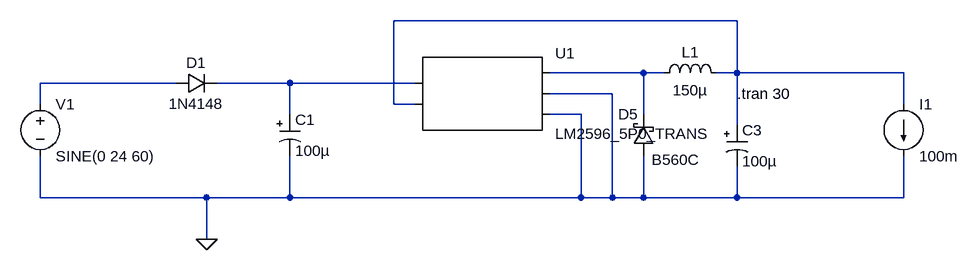
[diagram p0: schematic 24AC_new.asc]
24AC_new.asc, the LTspice schematic file:
Version 4
SHEET 1 2044 680
WIRE 1296 64 768 64
WIRE 1152 144 1008 144
WIRE 1184 144 1152 144
WIRE 1296 144 1296 64
WIRE 1296 144 1264 144
WIRE 1552 144 1296 144
WIRE 432 160 224 160
WIRE 608 160 496 160
WIRE 800 160 608 160
WIRE 1104 176 1008 176
WIRE 224 192 224 160
WIRE 768 192 768 64
WIRE 800 192 768 192
WIRE 1552 192 1552 144
WIRE 608 208 608 160
WIRE 1056 208 1008 208
WIRE 1152 208 1152 144
WIRE 1296 224 1296 144
WIRE 224 336 224 272
WIRE 480 336 224 336
WIRE 608 336 608 272
WIRE 608 336 480 336
WIRE 1056 336 1056 208
WIRE 1056 336 608 336
WIRE 1104 336 1104 176
WIRE 1104 336 1056 336
WIRE 1152 336 1152 272
WIRE 1152 336 1104 336
WIRE 1296 336 1296 288
WIRE 1296 336 1152 336
WIRE 1552 336 1552 272
WIRE 1552 336 1296 336
WIRE 480 400 480 336
FLAG 480 400 0
SYMBOL voltage 224 176 R0
WINDOW 123 24 124 Left 2
WINDOW 39 0 0 Left 0
SYMATTR InstName V1
SYMATTR Value SINE(0 24 60)
SYMBOL polcap 592 208 R0
WINDOW 3 24 56 Left 2
SYMATTR Value 100µ
SYMATTR InstName C1
SYMATTR SpiceLine V=50 Irms=1.69 Rser=0.035 Lser=0
SYMATTR Description Capacitor
SYMATTR Type cap
SYMBOL ind 1168 160 R270
WINDOW 0 32 56 VTop 2
WINDOW 3 5 56 VBottom 2
SYMATTR InstName L1
SYMATTR Value 150µ
SYMATTR SpiceLine Ipk=8.7 Rser=0.042 Rpar=0 Cpar=0
SYMBOL polcap 1280 224 R0
WINDOW 3 24 56 Left 2
SYMATTR Value 100µ
SYMATTR InstName C3
SYMATTR SpiceLine V=25 Irms=625m Rser=0.1 Lser=0
SYMATTR Description Capacitor
SYMATTR Type cap
SYMBOL AutoGenerated\\LM2596_5P0_TRANS 896 176 R0
SYMATTR InstName U1
SYMBOL schottky 1168 272 R180
WINDOW 0 24 64 Left 2
WINDOW 3 -70 -6 Left 2
SYMATTR InstName D5
SYMATTR Value B560C
SYMATTR Description Diode
SYMATTR Type diode
SYMBOL diode 432 176 R270
WINDOW 0 32 32 VTop 2
WINDOW 3 0 32 VBottom 2
SYMATTR InstName D1
SYMATTR Value 1N4148
SYMBOL current 1552 192 R0
WINDOW 123 0 0 Left 0
WINDOW 39 0 0 Left 0
SYMATTR InstName I1
SYMATTR Value 100m
TEXT 1296 176 Left 2 !.tran 30

The netlist it stands for:
* 24AC_new.asc
V1 N003 0 SINE(0 24 60)
C1 N004 0 100µ V=50 Irms=1.69 Rser=0.035 Lser=0
L1 N002 N001 150µ Ipk=8.7 Rser=0.042 Rpar=0 Cpar=0
C3 N001 0 100µ V=25 Irms=625m Rser=0.1 Lser=0
* U1: LM2596_5P0_TRANS (symbol AutoGenerated\LM2596_5P0_TRANS not available, pins judged from their places): pin1=N004 pin2=N001 pin3=N002 pin4=0 pin5=0
D5 0 N002 B560C
D1 N003 N004 1N4148
I1 N001 0 100m
.model D D
.lib standard.dio
.tran 30
.backanno
.end